# Altium project Mag_Encoder_Rev02.PrjPcb
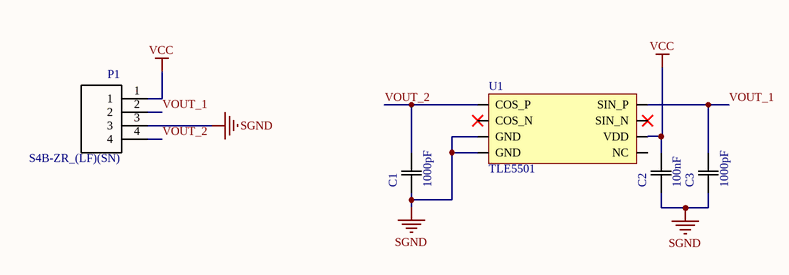
[diagram p0: Mag_Encoder_TLE5501.SchDoc]
1 sheet, 5 parts. Net scope: global (net labels, ports and power ports of the same name join across sheets).
Board file: Mag_Encoder_TLE5501.PcbDoc

## Sheet Mag_Encoder_TLE5501.SchDoc
size A

### Parts
C1  1000pF  [0805]
C2  100nF  [0805]
C3  1000pF  [0805]
P1  S4B-ZR_(LF)(SN)  [*JST_S4B-ZR(LF)(SN)]
U1  TLE5501  [8-SOIC TLE5XXX ENC]

### Nets
SGND: C1.1(C1) C2.1(C1) C3.1(C1) P1.3 U1.3(GND) U1.4(GND)
VCC: C2.2(C2) P1.1 U1.6(VDD)
VOUT_1: C3.2(C2) P1.2 U1.8(SIN_P)
VOUT_2: C1.2(C2) P1.4 U1.1(COS_P)

Not connected (* = marked no-connect by the designer): U1 2(COS_N)* 5(NC) 7(SIN_N)*

### Library data of the parts
C1 C3 = CAP 1000pF 0805: CAP CER 1000PF 50V X7R 0805; MP: C0805C102K5RACTU; MF: Kemet; Tolerance: 10%; Package: 0805; Price: 0.1 CAD; Value: 1000pF; Digikey: 399-1147-1-ND; Digikey Link: https://www.digikey.ca/product-detail/en/kemet/C0805C102K5RACTU/399-1147-1-ND/411422; Rating: 50V; Temperature Coefficient: X7R
C2 = CAP 100nF 0805: CAP CER 0.1UF 50V X7R 0805; MP: CC0805KRX7R9BB104; MF: Yageo; Tolerance: 10%; Package: 0805; Price: 0,119 CAD; Value: 100nF; Digikey: 311-1140-1-ND; Digikey Link: https://www.digikey.ca/products/en?keywords=311-1140-1-ND; Rating: 50V
P1 = S4B-ZR_(LF)(SN): Conn Shrouded Header HDR 4 POS 1.5mm Solder RA Thru-Hole Box; MP: S4B-ZR _LF__SN_; MF: JST Sales; Package: None; Price: None; Digikey PN: 455-1671-ND
U1 = TLE5501: TMR 360deg Magnetic Encoder; Manufacturer: Infineon Technologies; Manufacturer Part Number: TLE5501E0001XUMA1; Digi-Key Part Number: TLE5501E0001XUMA1DKR-ND; Footprint: 8-SOIC; Package: PG-DSO-8-16